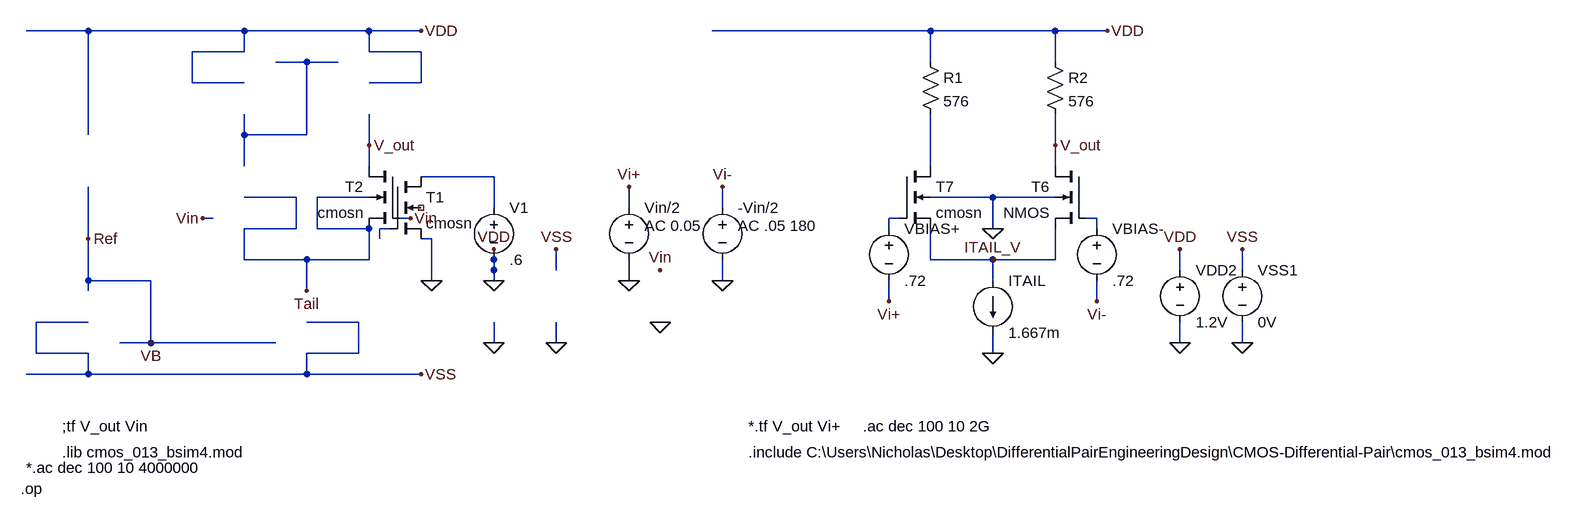
[diagram p0: schematic old_differential_pair.asc]
old_differential_pair.asc, the LTspice schematic file:
Version 4
<<<<<<< Updated upstream
<<<<<<< Updated upstream
<<<<<<< Updated upstream
<<<<<<< Updated upstream
SHEET 1 2672 680
WIRE 1568 -32 1232 -32
WIRE 1760 -32 1568 -32
WIRE 1840 -32 1760 -32
WIRE 1568 16 1568 -32
WIRE 1760 16 1760 -32
WIRE 1760 144 1760 96
WIRE 1568 176 1568 96
WIRE 1760 176 1760 144
WIRE 896 192 784 192
WIRE 1664 224 1568 224
WIRE 1760 224 1664 224
WIRE 896 240 896 192
WIRE 1104 240 1104 208
WIRE 1248 240 1248 208
WIRE 1520 256 1504 256
WIRE 1824 256 1808 256
WIRE 736 272 720 272
WIRE 1504 272 1504 256
WIRE 1664 272 1664 224
WIRE 1824 272 1824 256
WIRE 720 288 720 272
WIRE 800 288 784 288
WIRE 1568 320 1568 272
WIRE 1664 320 1568 320
WIRE 1760 320 1760 272
WIRE 1760 320 1664 320
WIRE 1952 336 1952 304
WIRE 2048 336 2048 304
WIRE 800 352 800 288
WIRE 896 352 896 320
WIRE 1104 352 1104 320
WIRE 1248 352 1248 320
WIRE 1664 352 1664 320
WIRE 1504 384 1504 352
WIRE 1824 384 1824 352
WIRE 1952 448 1952 416
WIRE 2048 448 2048 416
WIRE 1664 464 1664 432
FLAG 1840 -32 VDD
FLAG 1952 448 0
FLAG 1952 304 VDD
FLAG 1760 144 V_out
FLAG 1504 384 Vi+
FLAG 2048 448 0
FLAG 2048 304 VSS
FLAG 1248 208 Vi-
FLAG 1248 352 0
FLAG 1664 272 0
FLAG 1664 464 0
FLAG 1824 384 Vi-
FLAG 1104 208 Vi+
FLAG 1104 352 0
FLAG 1664 320 ITAIL_V
FLAG 896 352 0
FLAG 800 352 0
SYMBOL nmos4 1808 176 M0
SYMATTR InstName T6
=======
=======
>>>>>>> Stashed changes
=======
>>>>>>> Stashed changes
=======
>>>>>>> Stashed changes
SHEET 1 2120 688
WIRE 272 -32 176 -32
WIRE 512 -32 272 -32
WIRE 704 -32 512 -32
WIRE 784 -32 704 -32
WIRE 512 0 512 -32
WIRE 512 0 432 0
WIRE 704 0 704 -32
WIRE 784 0 704 0
WIRE 608 16 560 16
WIRE 656 16 608 16
WIRE 432 48 432 0
WIRE 512 48 432 48
WIRE 784 48 784 0
WIRE 784 48 704 48
WIRE 272 128 272 -32
WIRE 512 128 512 96
WIRE 608 128 608 16
WIRE 608 128 512 128
WIRE 704 144 704 96
WIRE 512 176 512 128
WIRE 704 176 704 144
WIRE 592 224 512 224
WIRE 704 224 624 224
WIRE 464 256 448 256
WIRE 768 256 752 256
WIRE 592 272 592 224
WIRE 592 272 512 272
WIRE 624 272 624 224
WIRE 704 272 624 272
WIRE 272 288 272 208
WIRE 512 320 512 272
WIRE 608 320 512 320
WIRE 704 320 704 272
WIRE 704 320 608 320
WIRE 896 336 896 304
WIRE 992 336 992 304
WIRE 272 352 272 288
WIRE 368 352 272 352
WIRE 272 368 272 352
WIRE 608 368 608 320
WIRE 272 416 192 416
WIRE 688 416 608 416
WIRE 368 448 368 352
WIRE 368 448 320 448
WIRE 560 448 368 448
WIRE 896 448 896 416
WIRE 992 448 992 416
WIRE 192 464 192 416
WIRE 272 464 192 464
WIRE 688 464 688 416
WIRE 688 464 608 464
WIRE 272 496 272 464
WIRE 272 496 176 496
WIRE 608 496 608 464
WIRE 608 496 272 496
WIRE 784 496 608 496
FLAG 784 -32 VDD
FLAG 896 448 0
FLAG 896 304 VDD
FLAG 704 144 V_out
FLAG 448 256 Vin
FLAG 768 256 Vin
FLAG 784 496 VSS
FLAG 992 448 0
FLAG 992 304 VSS
FLAG 368 448 VB
FLAG 1152 416 0
FLAG 1152 336 Vin
FLAG 608 368 Tail
FLAG 272 288 Ref
SYMBOL nmos4 752 176 M0
SYMATTR InstName T2
>>>>>>> Stashed changes
SYMATTR Value cmosn
SYMATTR Value2 l=0.13u w=10u
SYMBOL nmos4 1520 176 R0
SYMATTR InstName T7
SYMATTR Value cmosn
SYMATTR Value2 l=0.13u w=10u
SYMBOL voltage 1952 320 R0
SYMATTR InstName VDD2
SYMATTR Value 1.2V
SYMBOL voltage 2048 320 R0
SYMATTR InstName VSS1
SYMATTR Value 0V
SYMBOL voltage 1504 256 R0
WINDOW 123 0 0 Left 0
WINDOW 39 0 0 Left 0
SYMATTR InstName VBIAS+
SYMATTR Value .72
SYMBOL voltage 1824 256 R0
WINDOW 123 0 0 Left 0
WINDOW 39 0 0 Left 0
SYMATTR InstName VBIAS-
SYMATTR Value .72
SYMBOL voltage 1248 224 R0
WINDOW 123 24 44 Left 2
WINDOW 39 0 0 Left 0
<<<<<<< Updated upstream
SYMATTR InstName -Vin/2
SYMATTR Value ""
SYMATTR Value2 AC .05 180
SYMBOL current 1664 352 R0
WINDOW 123 0 0 Left 0
WINDOW 39 0 0 Left 0
SYMATTR InstName ITAIL
SYMATTR Value 1.667m
SYMBOL res 1552 0 R0
SYMATTR InstName R1
SYMATTR Value 576
SYMBOL res 1744 0 R0
SYMATTR InstName R2
SYMATTR Value 576
SYMBOL voltage 1104 224 R0
WINDOW 123 24 44 Left 2
WINDOW 39 0 0 Left 0
SYMATTR InstName Vin/2
SYMATTR Value ""
SYMATTR Value2 AC 0.05
SYMBOL nmos4 736 192 R0
SYMATTR InstName T1
SYMATTR Value cmosn
SYMATTR Value2 l=0.13u w=10u
SYMBOL voltage 896 224 R0
SYMATTR InstName VDD1
SYMATTR Value 1.2V
TEXT 1288 616 Left 2 !.include C:\\Users\\Nicholas\\Desktop\\DifferentialPairEngineeringDesign\\CMOS-Differential-Pair\\cmos_013_bsim4.mod
TEXT 1288 576 Left 2 !*.tf V_out Vi+
TEXT 1464 576 Left 2 !.ac dec 100 10 2G
=======
SYMATTR Value2 AC 1
SYMATTR InstName V1
SYMATTR Value .6
TEXT 232 616 Left 2 !.lib cmos_013_bsim4.mod
TEXT 232 576 Left 2 !;tf V_out Vin
TEXT 176 640 Left 2 !*.ac dec 100 10 4000000
TEXT 168 672 Left 2 !.op
<<<<<<< Updated upstream
<<<<<<< Updated upstream
<<<<<<< Updated upstream
>>>>>>> Stashed changes
=======
>>>>>>> Stashed changes
=======
>>>>>>> Stashed changes
=======
>>>>>>> Stashed changes

The netlist it stands for:
* old_differential_pair.asc
M§T6 V_out N004 ITAIL_V 0 NMOS
M§T2 V_out Vin Tail Tail cmosn l=0.13u w=10u
M§T7 N001 N003 ITAIL_V 0 cmosn l=0.13u w=10u
VDD2 0 0 1.2V
VSS1 VSS 0 0V
VBIAS+ N003 Vi+ .72
VBIAS- N004 Vi- .72
V§-Vin/2 Vi- 0 AC .05 180
ITAIL ITAIL_V 0 1.667m
R1 0 N001 576
R2 0 V_out 576
Vin/2 Vi+ 0 AC 0.05
M§T1 N002 N005 0 NC_01 cmosn l=0.13u w=10u
V1 N002 0 .6 AC 1
.model NMOS NMOS
.model PMOS PMOS
.lib standard.mos
.include C:\Users\Nicholas\Desktop\DifferentialPairEngineeringDesign\CMOS-Differential-Pair\cmos_013_bsim4.mod
*.tf V_out Vi+
.ac dec 100 10 2G
.lib cmos_013_bsim4.mod
;tf V_out Vin
*.ac dec 100 10 4000000
.op
.backanno
.end